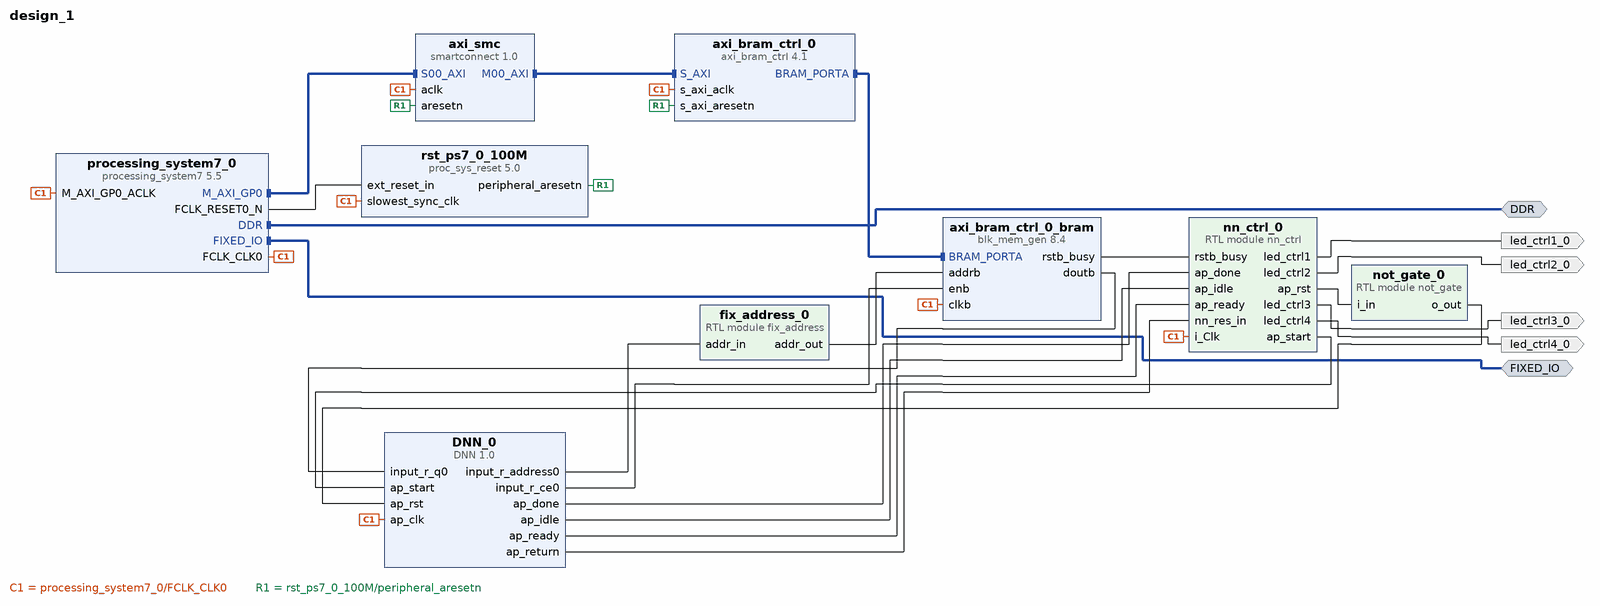
[diagram p0: block diagram of the top level]
# Vivado block design design_1, xc7z020clg400-1, Vivado 2021.1
create_bd_design design_1

create_bd_intf_port -mode Master -vlnv xilinx.com:interface:ddrx_rtl:1.0 DDR
create_bd_intf_port -mode Master -vlnv xilinx.com:display_processing_system7:fixedio_rtl:1.0 FIXED_IO
create_bd_port -dir O led_ctrl1_0
create_bd_port -dir O led_ctrl2_0
create_bd_port -dir O led_ctrl3_0
create_bd_port -dir O led_ctrl4_0

create_bd_cell -type ip -vlnv xilinx.com:ip:processing_system7:5.5 processing_system7_0
set_property -dict [list \
  CONFIG.PCW_APU_PERIPHERAL_FREQMHZ 650 \
  CONFIG.PCW_CRYSTAL_PERIPHERAL_FREQMHZ 50 \
  CONFIG.PCW_ENET0_PERIPHERAL_ENABLE 0 \
  CONFIG.PCW_FPGA0_PERIPHERAL_FREQMHZ 100 \
  CONFIG.PCW_FPGA1_PERIPHERAL_FREQMHZ 50 \
  CONFIG.PCW_GPIO_MIO_GPIO_ENABLE 0 \
  CONFIG.PCW_M_AXI_GP0_FREQMHZ 10 \
  CONFIG.PCW_PERIPHERAL_BOARD_PRESET None \
  CONFIG.PCW_PRESET_BANK1_VOLTAGE {LVCMOS 1.8V} \
  CONFIG.PCW_QSPI_PERIPHERAL_ENABLE 0 \
  CONFIG.PCW_SD0_PERIPHERAL_ENABLE 0 \
  CONFIG.PCW_SDIO_PERIPHERAL_FREQMHZ 50 \
  CONFIG.PCW_UART0_PERIPHERAL_ENABLE 1 \
  CONFIG.PCW_UART0_UART0_IO {MIO 14 .. 15} \
  CONFIG.PCW_UART1_PERIPHERAL_ENABLE 0 \
  CONFIG.PCW_UART_PERIPHERAL_FREQMHZ 100 \
  CONFIG.PCW_UIPARAM_DDR_BUS_WIDTH {16 Bit} \
  CONFIG.PCW_UIPARAM_DDR_FREQ_MHZ 525 \
  CONFIG.PCW_UIPARAM_DDR_PARTNO {MT41J256M16 RE-125} \
  CONFIG.PCW_USB0_PERIPHERAL_ENABLE 0 \
] [get_bd_cells processing_system7_0]
# 321 more settings of processing_system7_0 are not shown: defaults, MIO pin electricals, DDR timing, and values the tool derives
create_bd_cell -type ip -vlnv xilinx.com:ip:axi_bram_ctrl:4.1 axi_bram_ctrl_0
set_property -dict {CONFIG.SINGLE_PORT_BRAM 1} [get_bd_cells axi_bram_ctrl_0]
create_bd_cell -type ip -vlnv xilinx.com:ip:blk_mem_gen:8.4 axi_bram_ctrl_0_bram
set_property -dict {CONFIG.Memory_Type True_Dual_Port_RAM} [get_bd_cells axi_bram_ctrl_0_bram]
create_bd_cell -type ip -vlnv xilinx.com:ip:smartconnect:1.0 axi_smc
set_property -dict {CONFIG.NUM_SI 1} [get_bd_cells axi_smc]
create_bd_cell -type ip -vlnv xilinx.com:ip:proc_sys_reset:5.0 rst_ps7_0_100M
create_bd_cell -type ip -vlnv xilinx.com:hls:DNN:1.0 DNN_0
create_bd_cell -type module -reference not_gate not_gate_0
create_bd_cell -type module -reference nn_ctrl nn_ctrl_0
create_bd_cell -type module -reference fix_address fix_address_0

# ---- connections ----

connect_bd_intf_net [get_bd_intf_pins axi_bram_ctrl_0_bram/BRAM_PORTA] [get_bd_intf_pins axi_bram_ctrl_0/BRAM_PORTA]
connect_bd_intf_net [get_bd_intf_pins axi_smc/M00_AXI] [get_bd_intf_pins axi_bram_ctrl_0/S_AXI]
connect_bd_intf_net [get_bd_intf_ports DDR] [get_bd_intf_pins processing_system7_0/DDR]
connect_bd_intf_net [get_bd_intf_ports FIXED_IO] [get_bd_intf_pins processing_system7_0/FIXED_IO]
connect_bd_intf_net [get_bd_intf_pins processing_system7_0/M_AXI_GP0] [get_bd_intf_pins axi_smc/S00_AXI]
connect_bd_net [get_bd_pins DNN_0/ap_done] [get_bd_pins nn_ctrl_0/ap_done]
connect_bd_net [get_bd_pins DNN_0/ap_idle] [get_bd_pins nn_ctrl_0/ap_idle]
connect_bd_net [get_bd_pins DNN_0/ap_ready] [get_bd_pins nn_ctrl_0/ap_ready]
connect_bd_net [get_bd_pins DNN_0/ap_return] [get_bd_pins nn_ctrl_0/nn_res_in]
connect_bd_net [get_bd_pins DNN_0/input_r_address0] [get_bd_pins fix_address_0/addr_in]
connect_bd_net [get_bd_pins DNN_0/input_r_ce0] [get_bd_pins axi_bram_ctrl_0_bram/enb]
connect_bd_net [get_bd_pins axi_bram_ctrl_0_bram/doutb] [get_bd_pins DNN_0/input_r_q0]
connect_bd_net [get_bd_pins axi_bram_ctrl_0_bram/rstb_busy] [get_bd_pins nn_ctrl_0/rstb_busy]
connect_bd_net [get_bd_pins fix_address_0/addr_out] [get_bd_pins axi_bram_ctrl_0_bram/addrb]
connect_bd_net [get_bd_pins nn_ctrl_0/ap_rst] [get_bd_pins not_gate_0/i_in]
connect_bd_net [get_bd_pins nn_ctrl_0/ap_start] [get_bd_pins DNN_0/ap_start]
connect_bd_net [get_bd_pins nn_ctrl_0/led_ctrl1] [get_bd_ports led_ctrl1_0]
connect_bd_net [get_bd_pins nn_ctrl_0/led_ctrl2] [get_bd_ports led_ctrl2_0]
connect_bd_net [get_bd_pins nn_ctrl_0/led_ctrl3] [get_bd_ports led_ctrl3_0]
connect_bd_net [get_bd_pins nn_ctrl_0/led_ctrl4] [get_bd_ports led_ctrl4_0]
connect_bd_net [get_bd_pins not_gate_0/o_out] [get_bd_pins DNN_0/ap_rst]
connect_bd_net [get_bd_pins processing_system7_0/FCLK_CLK0] \
  [get_bd_pins processing_system7_0/M_AXI_GP0_ACLK] [get_bd_pins axi_smc/aclk] [get_bd_pins axi_bram_ctrl_0/s_axi_aclk] \
  [get_bd_pins rst_ps7_0_100M/slowest_sync_clk] [get_bd_pins nn_ctrl_0/i_Clk] [get_bd_pins DNN_0/ap_clk] \
  [get_bd_pins axi_bram_ctrl_0_bram/clkb]
connect_bd_net [get_bd_pins processing_system7_0/FCLK_RESET0_N] [get_bd_pins rst_ps7_0_100M/ext_reset_in]
connect_bd_net [get_bd_pins rst_ps7_0_100M/peripheral_aresetn] [get_bd_pins axi_bram_ctrl_0/s_axi_aresetn] [get_bd_pins axi_smc/aresetn]
set_property HDL_ATTRIBUTE.BMM_INFO_PROCESSOR {arm > design_1 axi_bram_ctrl_0} [get_bd_cells processing_system7_0]
set_property HDL_ATTRIBUTE.KEEP_HIERARCHY yes [get_bd_cells processing_system7_0]
set_property HDL_ATTRIBUTE.BMM_INFO_ADDRESS_SPACE {byte  0x40000000 32 > design_1 axi_bram_ctrl_0_bram} [get_bd_cells axi_bram_ctrl_0]
set_property HDL_ATTRIBUTE.KEEP_HIERARCHY yes [get_bd_cells axi_bram_ctrl_0]

# ---- address map ----
assign_bd_address -offset 0x40000000 -range 8K -target_address_space [get_bd_addr_spaces processing_system7_0/Data] [get_bd_addr_segs axi_bram_ctrl_0/S_AXI/Mem0]

validate_bd_design
save_bd_design
